# EAGLE design main_board_v003 (EAGLE 9.6.2)
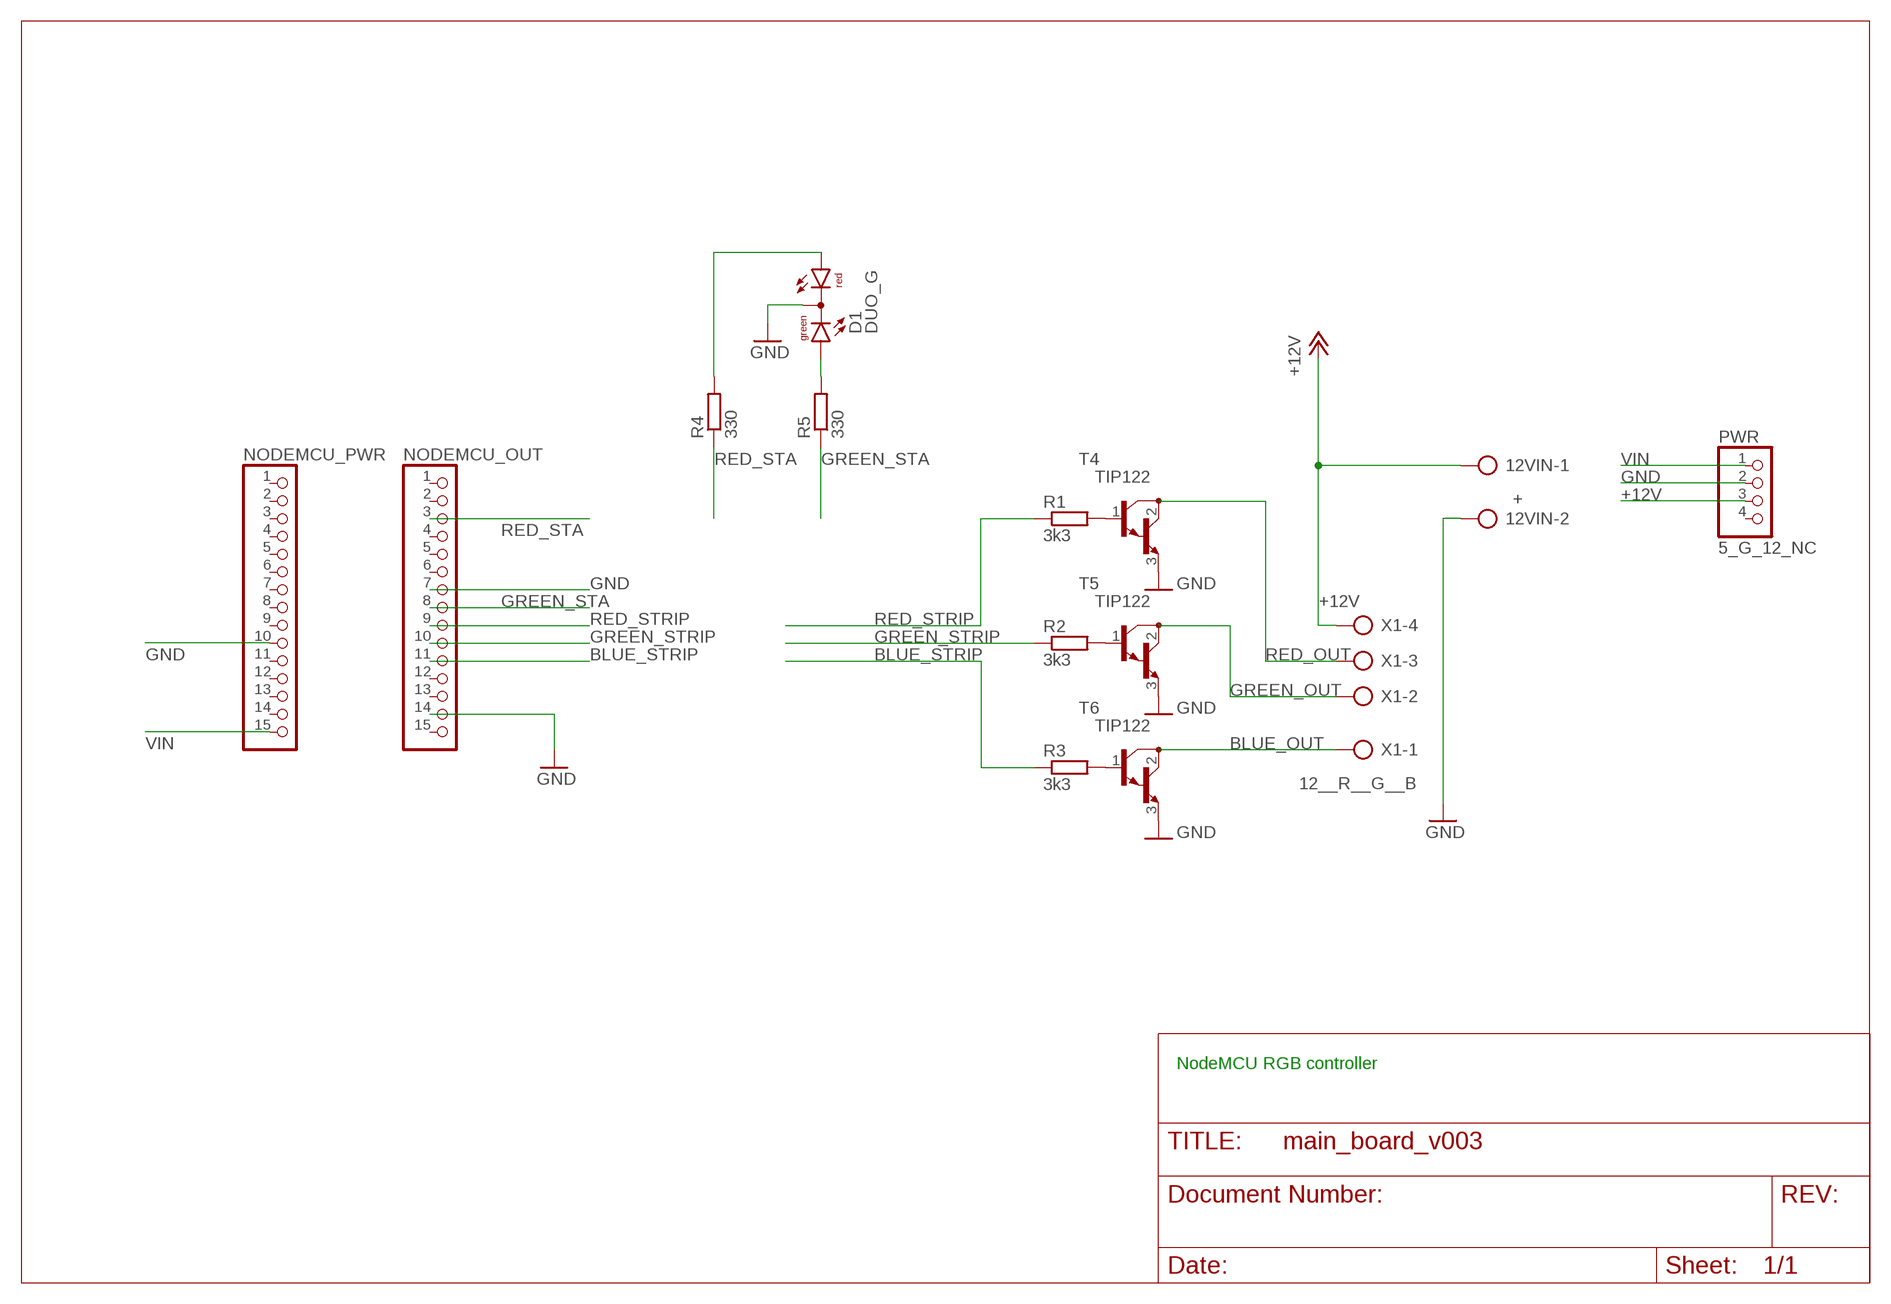
[diagram p0: schematic, sheet 1]

## Parts
12VIN  +  AK500/2-H  [AK500/2-H]
D1  DUO_G  DUOLED2X5  [DUOLED2X5]
NODEMCU_OUT  PINHD-1X15  [1X15]
NODEMCU_PWR  PINHD-1X15  [1X15]
PWR  5_G_12_NC  PINHD-1X4  [1X04]
R1  3k3  R-EU_0207/10  [0207/10]
R2  3k3  R-EU_0207/10  [0207/10]
R3  3k3  R-EU_0207/10  [0207/10]
R4  330  R-EU_0207/10  [0207/10]
R5  330  R-EU_0207/10  [0207/10]
T4  TIP122  [TO220]
T5  TIP122  [TO220]
T6  TIP122  [TO220]
X1  12__R__G__B  AK500/4-H  [AK500/4-H]

## Nets
+12V: 12VIN.1 PWR.3 X1.4
BLUE_OUT: T6.2(C) X1.1
BLUE_STRIP: NODEMCU_OUT.11 R3.1
GND: 12VIN.2 D1.K(C) NODEMCU_OUT.7 NODEMCU_OUT.14 NODEMCU_PWR.10 PWR.2 T4.3(E) T5.3(E) T6.3(E)
GREEN_OUT: T5.2(C) X1.2
GREEN_STA: NODEMCU_OUT.8 R5.1
GREEN_STRIP: NODEMCU_OUT.10 R2.1
N$1: R1.2 T4.1(B)
N$2: R2.2 T5.1(B)
N$3: R3.2 T6.1(B)
N$11: D1.AR R4.2
N$14: D1.AG R5.2
RED_OUT: T4.2(C) X1.3
RED_STA: NODEMCU_OUT.3 R4.1
RED_STRIP: NODEMCU_OUT.9 R1.1
VIN: NODEMCU_PWR.15 PWR.1
Unconnected: NODEMCU_OUT.1 NODEMCU_OUT.2 NODEMCU_OUT.4 NODEMCU_OUT.5 NODEMCU_OUT.6 NODEMCU_OUT.12 NODEMCU_OUT.13 NODEMCU_OUT.15 NODEMCU_PWR.1 NODEMCU_PWR.2 NODEMCU_PWR.3 NODEMCU_PWR.4 NODEMCU_PWR.5 NODEMCU_PWR.6 NODEMCU_PWR.7 NODEMCU_PWR.8 NODEMCU_PWR.9 NODEMCU_PWR.11 NODEMCU_PWR.12 NODEMCU_PWR.13 NODEMCU_PWR.14 PWR.4

## Notes on the sheet
- NodeMCU RGB controller

## Library data of the parts
12VIN = con-ptr500:AK500/2-H: CONNECTOR Aug. 2004 / PTR Meßtechnik: Die Bezeichnung der Serie AK505 wurde geändert. Es handelt sich hierbei um AK500 in horizontaler Ausführung.; OC_FARNELL: unknown; OC_NEWARK: unknown
D1 = led:DUOLED2X5: DUO LED 2 colors, 2.5 x 5 mm, recangle
NODEMCU_OUT NODEMCU_PWR = pinhead:PINHD-1X15: PIN HEADER
PWR = pinhead:PINHD-1X4: PIN HEADER
R1-R5 = rcl:R-EU_: RESISTOR, European symbol; SPICEPREFIX: R
T4-T6 = transistor-neu-to92_220:TIP122: NPN BIPOLAR DARLINGTON TRANSISTOR
X1 = con-ptr500:AK500/4-H: CONNECTOR Aug. 2004 / PTR Meßtechnik: Die Bezeichnung der Serie AK505 wurde geändert. Es handelt sich hierbei um AK500 in horizontaler Ausführung.; OC_FARNELL: unknown; OC_NEWARK: unknown

## Net classes
0 default: width 0.508 mm, clearance 0.127 mm

## Board
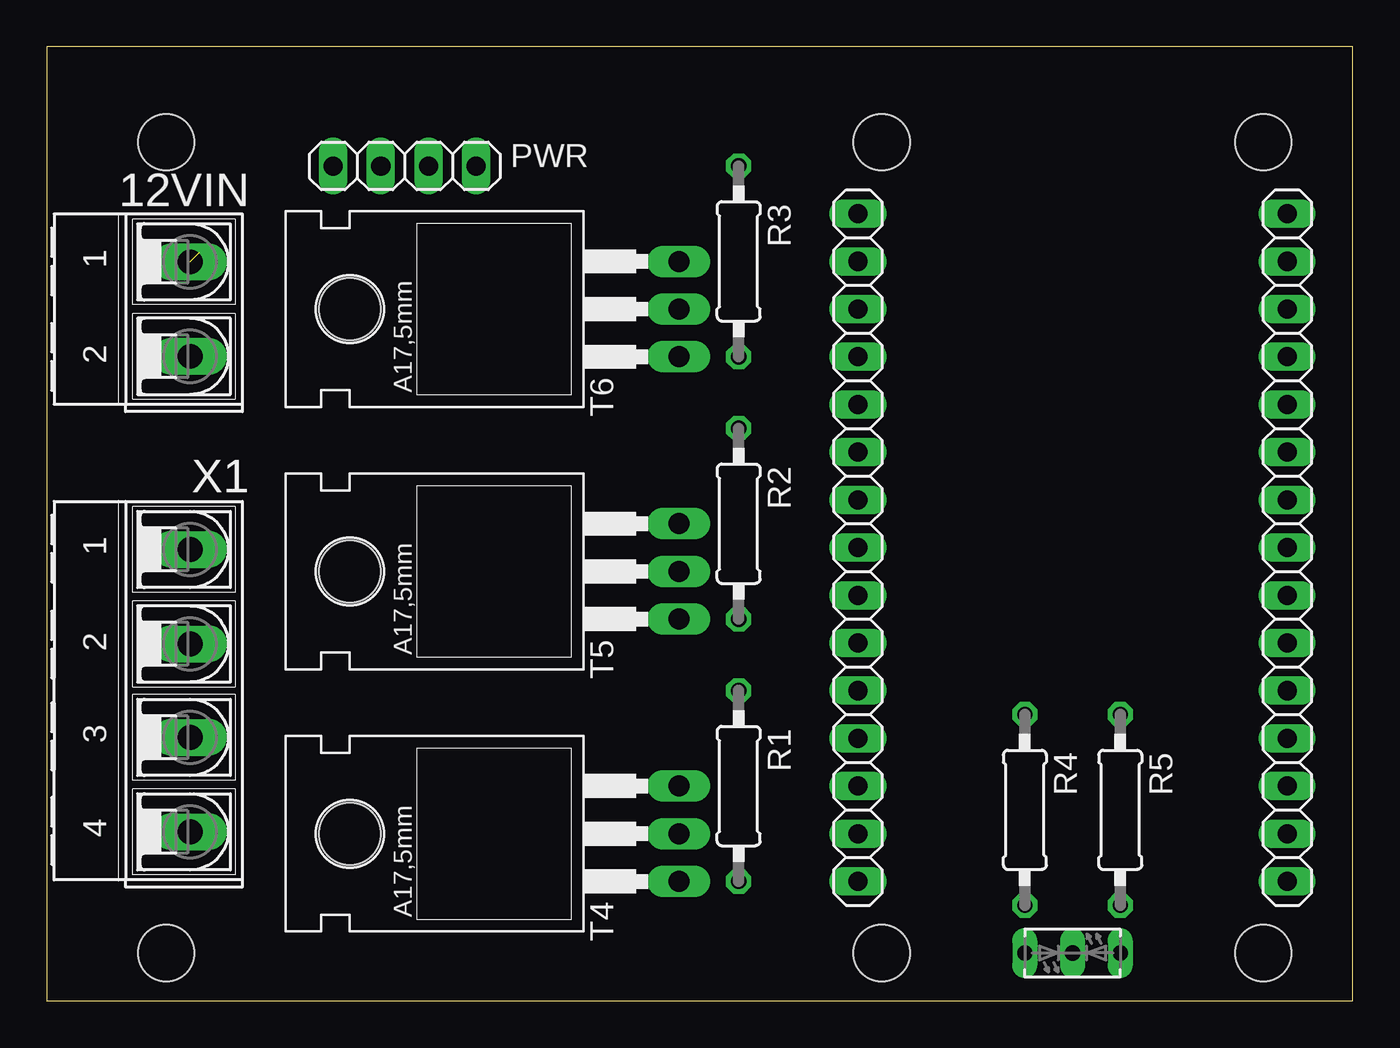
[diagram p1: board, top side]
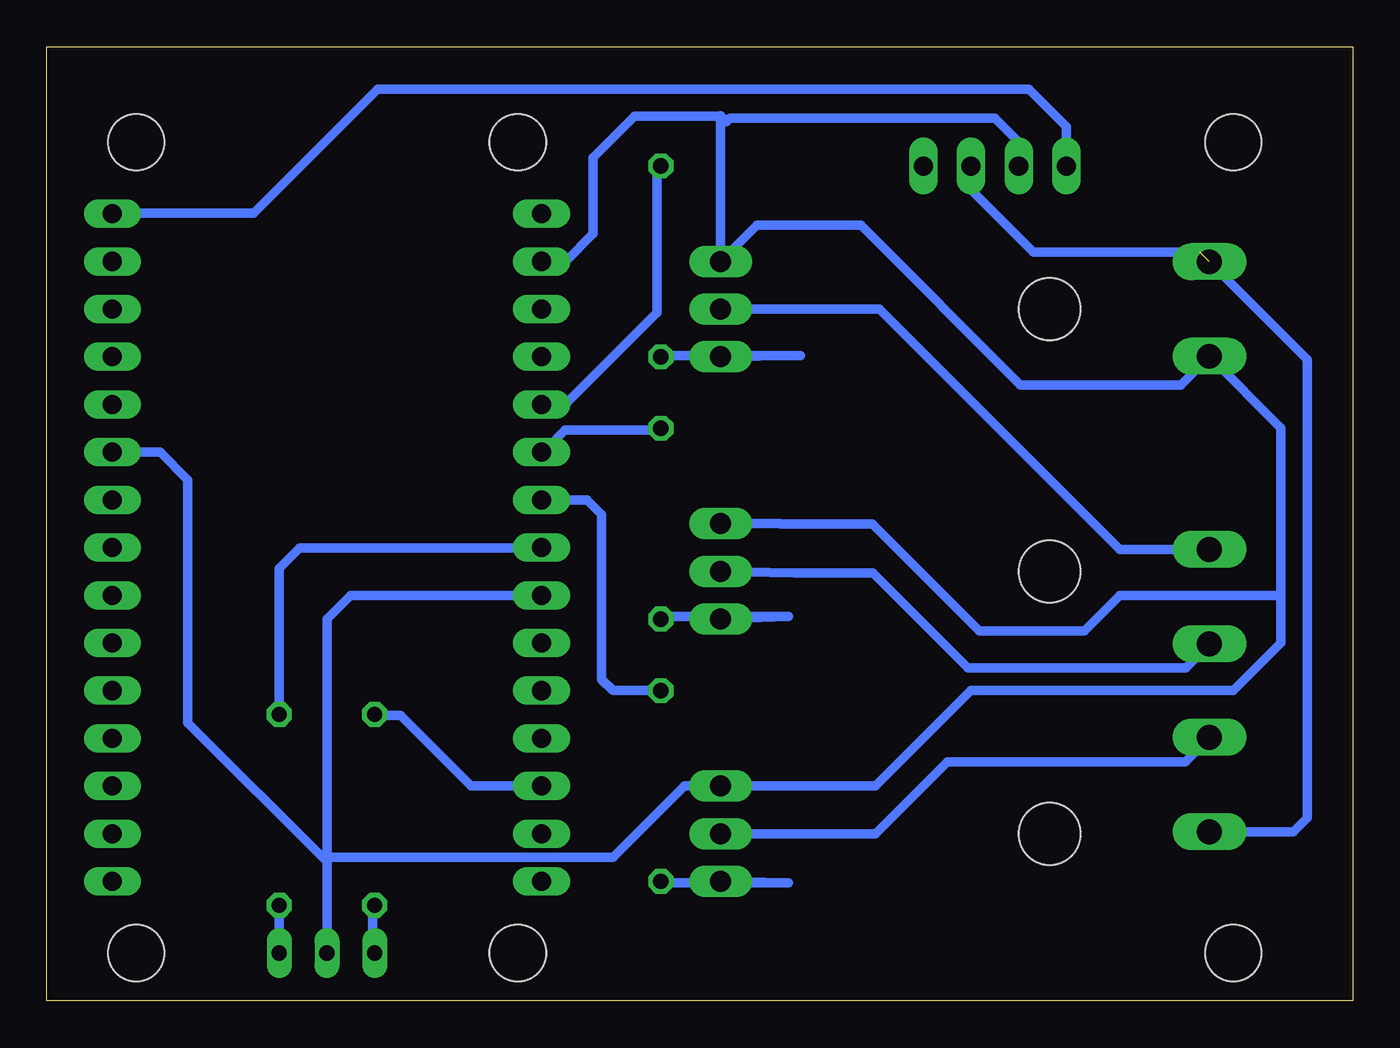
[diagram p2: board, bottom side, seen from below]

Size 69.52 x 50.79 mm. Coordinates in mm from the lower left corner, seen from the top.
Outline: 0,0 69.52,0 69.52,50.79 0,50.79 0,0
Copper layers (1*16): Top 0.035mm / dielectric 1.5mm / Bottom 0.035mm
Design rules "default": minimum track width 6mil, minimum drill 0.35mm, track to track 6mil, track to pad 6mil, pad to pad 6mil, via to via 6mil, smd to smd 6mil, copper to edge 40mil, drill to drill 6mil, minimum pad ring 10mil, minimum via ring 8mil, stop-mask expansion 4mil, vias tented up to drill 0mil, thermal gap 10mil
Holes 3 mm at 64.77,2.54 44.45,2.54 64.77,45.72 44.45,45.72 6.35,2.54 6.35,45.72

### Footprints (pad centres in the part's own frame; a part is rotated, then mirrored left to right if it is on the bottom)
AK500/2-H = drill 1.321 long: 1 -2.515,0; 2 2.515,0
DUOLED2X5 = drill 0.813 long: AG -2.54,0; AR 2.54,0; K 0,0
1X15 = drill 1.016 long: 1 -17.78,0; 2 -15.24,0; 3 -12.7,0; 4 -10.16,0; 5 -7.62,0; 6 -5.08,0; 7 -2.54,0; 8 0,0; 9 2.54,0; 10 5.08,0; 11 7.62,0; 12 10.16,0; 13 12.7,0; 14 15.24,0; 15 17.78,0
1X04 = drill 1.016 long: 1 -3.81,0; 2 -1.27,0; 3 1.27,0; 4 3.81,0
0207/10 = drill 0.813 octagon: 1 -5.08,0; 2 5.08,0
TO220 = drill 1.118 long: 1 -2.54,-6.35; 2 0,-6.35; 3 2.54,-6.35 | hole 3.302: 0,11.176
AK500/4-H = drill 1.321 long: 1 -7.518,0; 2 -2.489,0; 3 2.489,0; 4 7.518,0

### Placement (x,y rotation side)
12VIN  7.62,36.83 270 top
D1  54.61,2.54 180 top
NODEMCU_OUT  43.18,24.13 90 top
NODEMCU_PWR  66.04,24.13 90 top
PWR  19.05,44.45 0 top
R1  36.83,11.43 270 top
R2  36.83,25.4 270 top
R3  36.83,39.37 270 top
R4  52.07,10.16 270 top
R5  57.15,10.16 270 top
T4  27.3,8.89 90 top
T5  27.3,22.86 90 top
T6  27.3,36.83 90 top
X1  7.62,16.51 270 top

### Tracks (layer width: path | path; a pad name or v marks a point on that pad's centre or on a via)
+12V  (1 unrouted)
  Bottom 0.508: X1.4 3.15,8.99 2.41,9.73 2.41,34.14 12VIN.1 | PWR.3 20.32,43.18 16.99,39.85 8.13,39.85
BLUE_OUT
  Bottom 0.508: X1.1 12.39,24.03 25.19,36.83 T6.2
BLUE_STRIP
  Bottom 0.508: R3.1 37.03,44.25 37.03,36.65 41.94,31.75 NODEMCU_OUT.11
GND
  Bottom 0.508: NODEMCU_OUT.14 41.91,39.37 40.44,40.84 40.44,44.89 38.23,47.1 33.64,47.1 | NODEMCU_OUT.7 53.34,21.59 54.61,20.32 54.61,7.62 | 54.61,7.62 D1.K 54.61,7.38 62.03,14.8 62.03,27.74 63.5,29.21 NODEMCU_PWR.10 | PWR.2 17.78,45.72 19.05,46.99 33.15,46.99 33.34,46.8 33.64,47.1 | 3.81,21.59 3.81,30.5 12VIN.2 9.14,32.79 17.68,32.79 26.19,41.3 31.73,41.3 T6.3 33.66,47.12 33.64,47.1 | 54.61,7.62 39.37,7.62 35.56,11.43 T4.3 25.4,11.43 20.32,16.51 6.35,16.51 3.81,19.05 3.81,21.59 | T5.3 30.48,25.4 30.45,25.38 25.57,25.38 19.88,19.68 14.29,19.68 12.38,21.59 3.81,21.59
GREEN_OUT
  Bottom 0.508: T5.2 29.69,22.78 25.53,22.78 20.47,17.73 8.89,17.73 X1.2
GREEN_STA
  Bottom 0.508: R5.1 57.15,23.01 56.06,24.11 43.26,24.11 NODEMCU_OUT.8
GREEN_STRIP
  Bottom 0.508: R2.1 37.03,30.38 41.94,30.38 42.93,29.39 NODEMCU_OUT.10
N$1
  Bottom 0.508: R1.2 36.7,6.27 30.02,6.27 T4.1
N$2
  Bottom 0.508: R2.2 36.7,20.47 30.02,20.47 T5.1
N$3
  Bottom 0.508: R3.2 36.7,34.34 29.39,34.34 29.4,34.35 T6.1
N$11
  Bottom 0.508: D1.AR 52.17,2.64 52.17,4.95 R4.2
N$14
  Bottom 0.508: D1.AG R5.2
RED_OUT
  Bottom 0.508: T4.2 25.4,8.89 21.57,12.72 8.94,12.72 8.89,12.75 X1.3
RED_STA
  Bottom 0.508: NODEMCU_OUT.3 46.94,11.43 50.7,15.19 51.84,15.19 R4.1
RED_STRIP
  Bottom 0.508: R1.1 39.37,16.51 39.98,17.12 39.98,25.88 40.77,26.67 NODEMCU_OUT.9
VIN
  Bottom 0.508: PWR.1 15.24,46.53 17.25,48.54 51.92,48.54 58.52,41.94 66.04,41.94 NODEMCU_PWR.15